# Altium schematic sheet Sh_core.SchDoc
size 420 x 297 mm; Address1: Address1; Address2: Address2; Address3: Address3; Address4: Address4; DocumentNumber: АБВГ.123456.001 Э3; SheetNumber: 1; Scale: 1:1; DocumentType: Схема электрическая принципиальная; FirstReferrence: АБВГ.123456.001
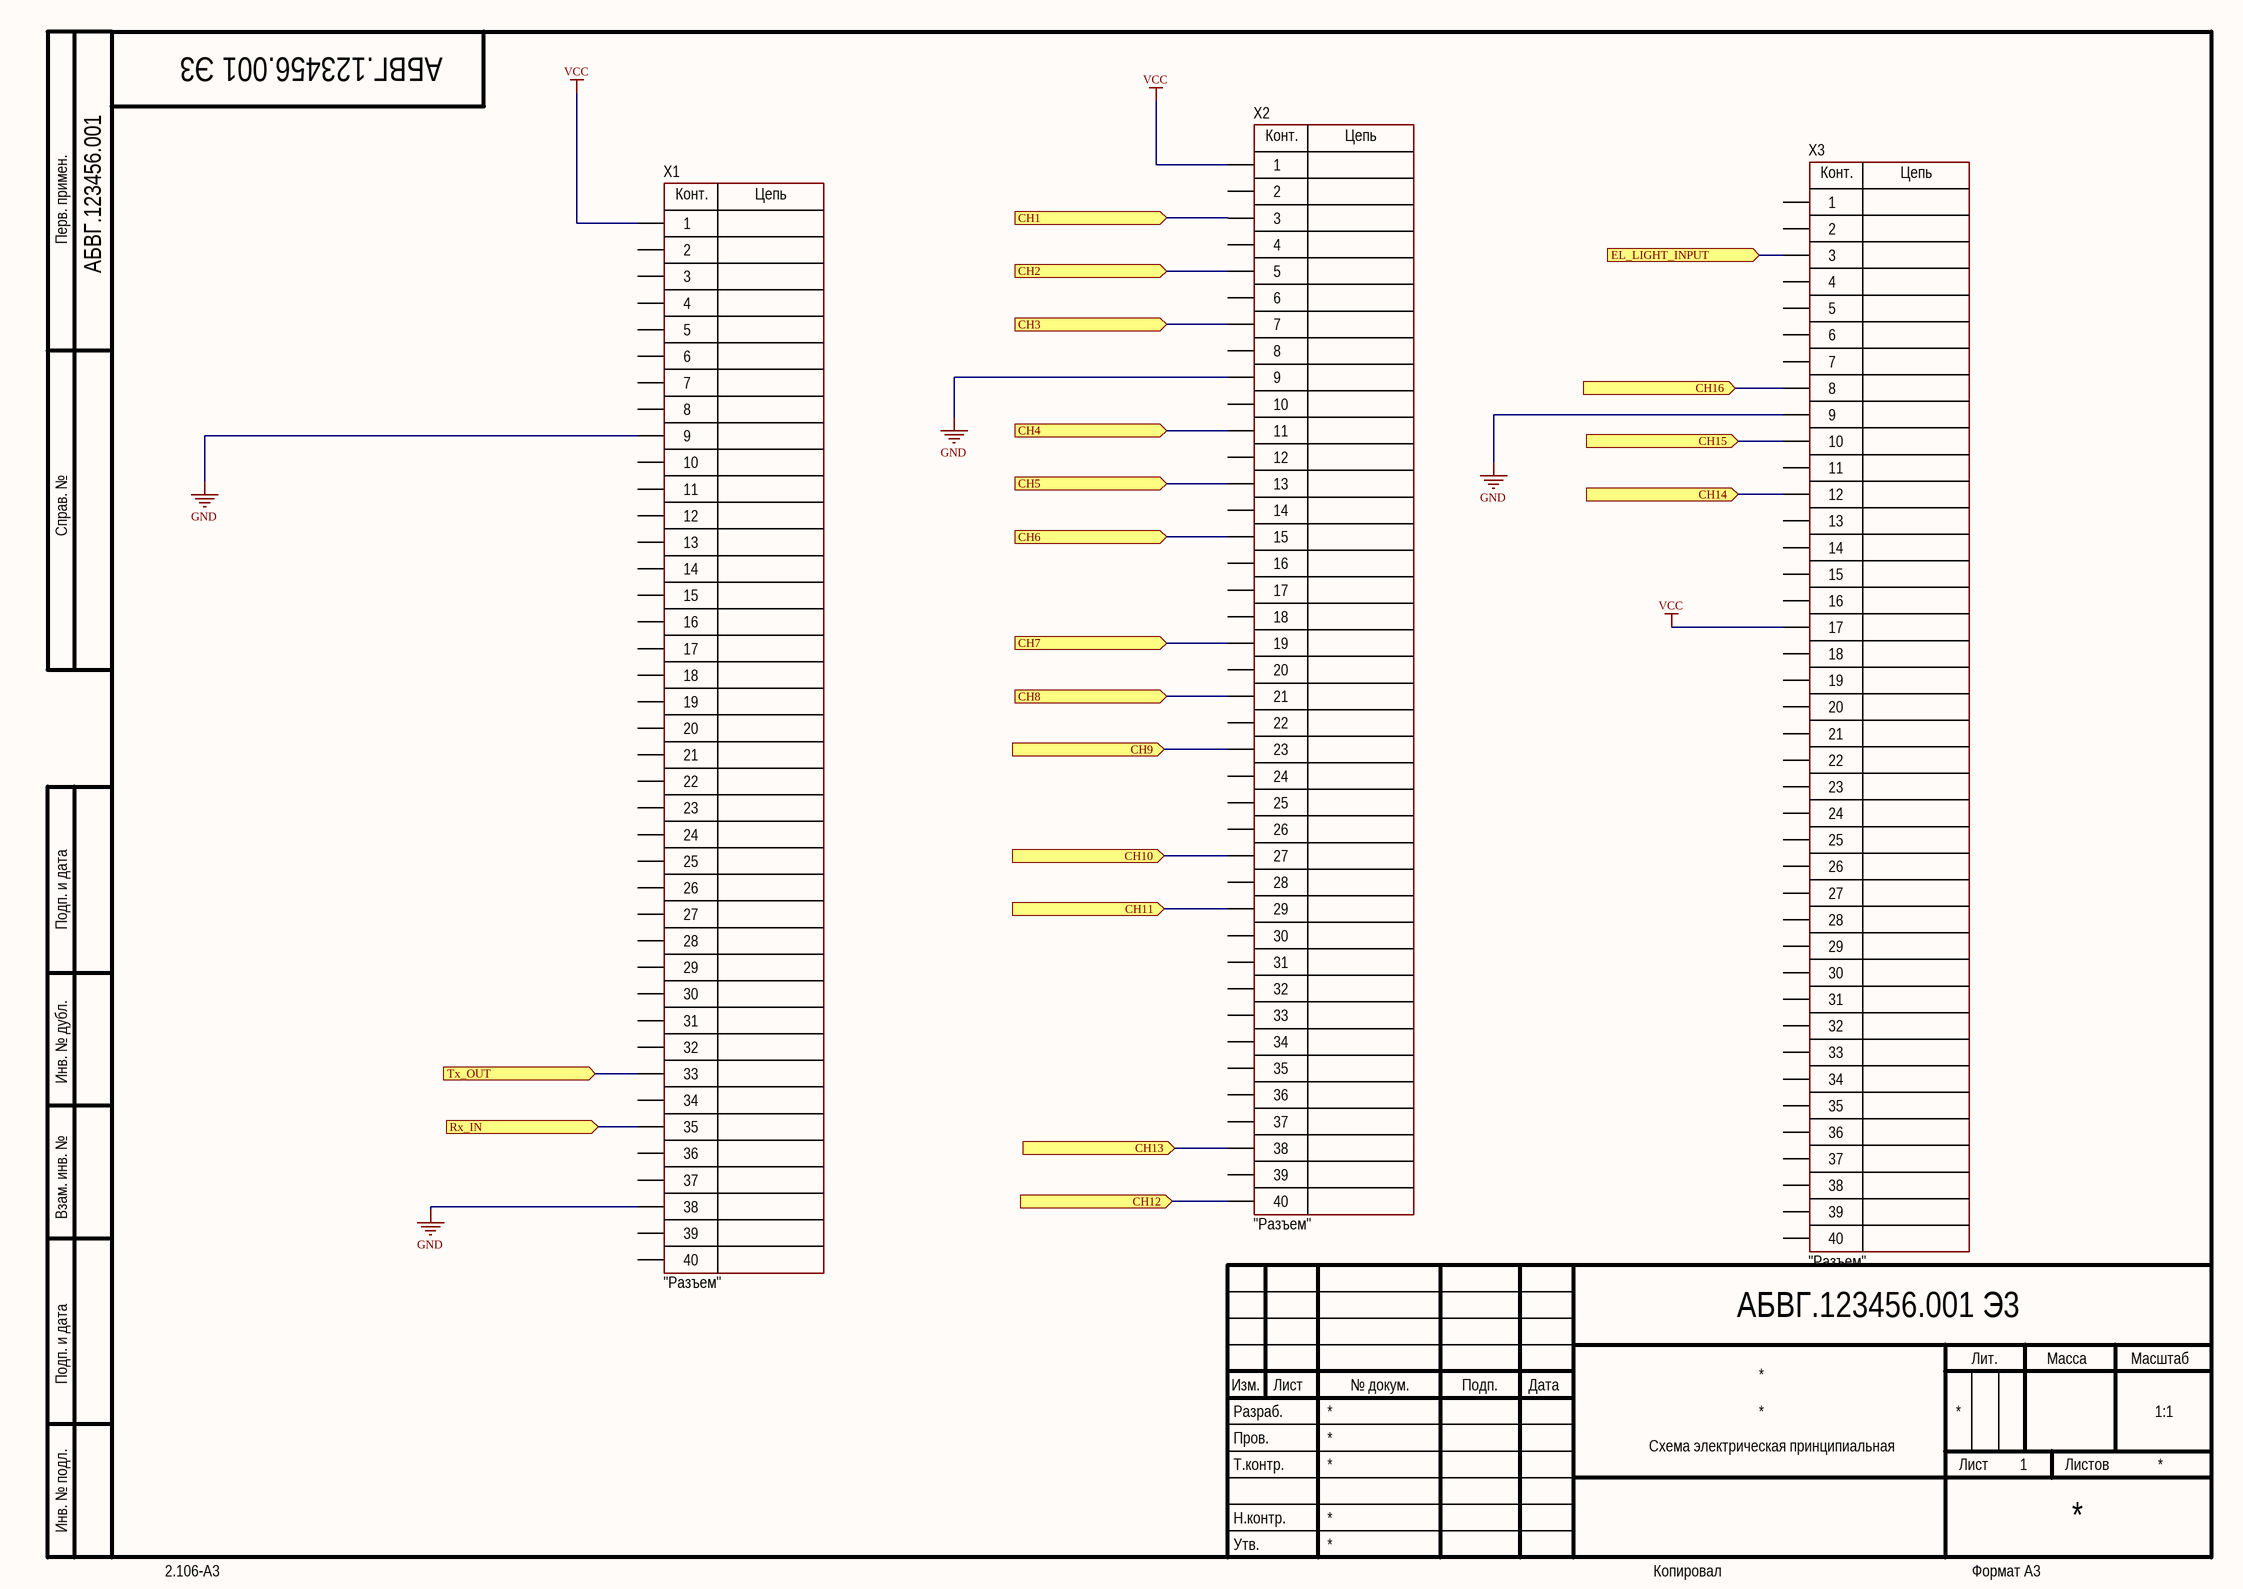
[diagram p0: Sh_core.SchDoc]

## Parts
X1  CommentText: "Разъем"  [CON: PBD-40 (2.54)]
X2  CommentText: "Разъем"  [CON: PBD-40 (2.54)]
X3  CommentText: "Разъем"  [CON: PBD-40 (2.54)]

## Ports
CH1 (in), CH2 (in), CH3 (in), CH4 (in), CH5 (in), CH6 (in), CH7 (in), CH8 (in), CH9 (in), CH10 (in), CH11 (in), CH12 (in), CH13 (in), CH14 (in), CH15 (in), CH16 (in), EL_LIGHT_INPUT (in), Rx_IN (in), Tx_OUT (in)

## Nets
GND: X1.9 X1.38 X2.9 X3.9
VCC: X1.1 X2.1 X3.17
CH1: X2.3 ; port CH1
CH2: X2.5 ; port CH2
CH3: X2.7 ; port CH3
CH4: X2.11 ; port CH4
CH5: X2.13 ; port CH5
CH6: X2.15 ; port CH6
CH7: X2.19 ; port CH7
CH8: X2.21 ; port CH8
CH9: X2.23 ; port CH9
CH10: X2.27 ; port CH10
CH11: X2.29 ; port CH11
CH12: X2.40 ; port CH12
CH13: X2.38 ; port CH13
CH14: X3.12 ; port CH14
CH15: X3.10 ; port CH15
CH16: X3.8 ; port CH16
EL_LIGHT_INPUT: X3.3 ; port EL_LIGHT_INPUT
Rx_IN: X1.35 ; port Rx_IN
Tx_OUT: X1.33 ; port Tx_OUT

Not connected (* = marked no-connect by the designer): X1 2 3 4 5 6 7 8 10 11 12 13 14 15 16 17 18 19 20 21 22 23 24 25 26 27 28 29 30 31 32 34 36 37 39 40; X2 2 4 6 8 10 12 14 16 17 18 20 22 24 25 26 28 30 31 32 33 34 35 36 37 39; X3 1 2 4 5 6 7 11 13 14 15 16 18 19 20 21 22 23 24 25 26 27 28 29 30 31 32 33 34 35 36 37 38 39 40

## Notes on the sheet
- Перв. примен.
- Справ. №
- Подп. и дата
- Инв. № дубл.
- Взам. инв. №
- Разраб.
- Изм.
- Лист
- № докум.
- Подп.
- Дата
- Лит.
- Масса
- Масштаб
- Пров.
- Т.контр.
- Листов
- Инв. № подл.
- Утв.
- Н.контр.
- 2.106-A3
- Копировал
- Формат А3
- (in symbol PBD-40) Конт.; Цепь

## Library data of the parts
X1-X3 = PBD-40: Manufacturer: Connfly; ValueManufacturerPartNumber: Connector, 20pin, 2.54mm, 500VAC, 3A; PartNumber: PLS-20; TypeConnector: Connector; VoltageMax: 500VAC; Pitch: 2.54mm; CurrentMax: 3A; Multichannel: 20pin; HelpURL: https://www.chipdip.ru/product/pls-20